# EAGLE design io-hub (EAGLE 5.10)
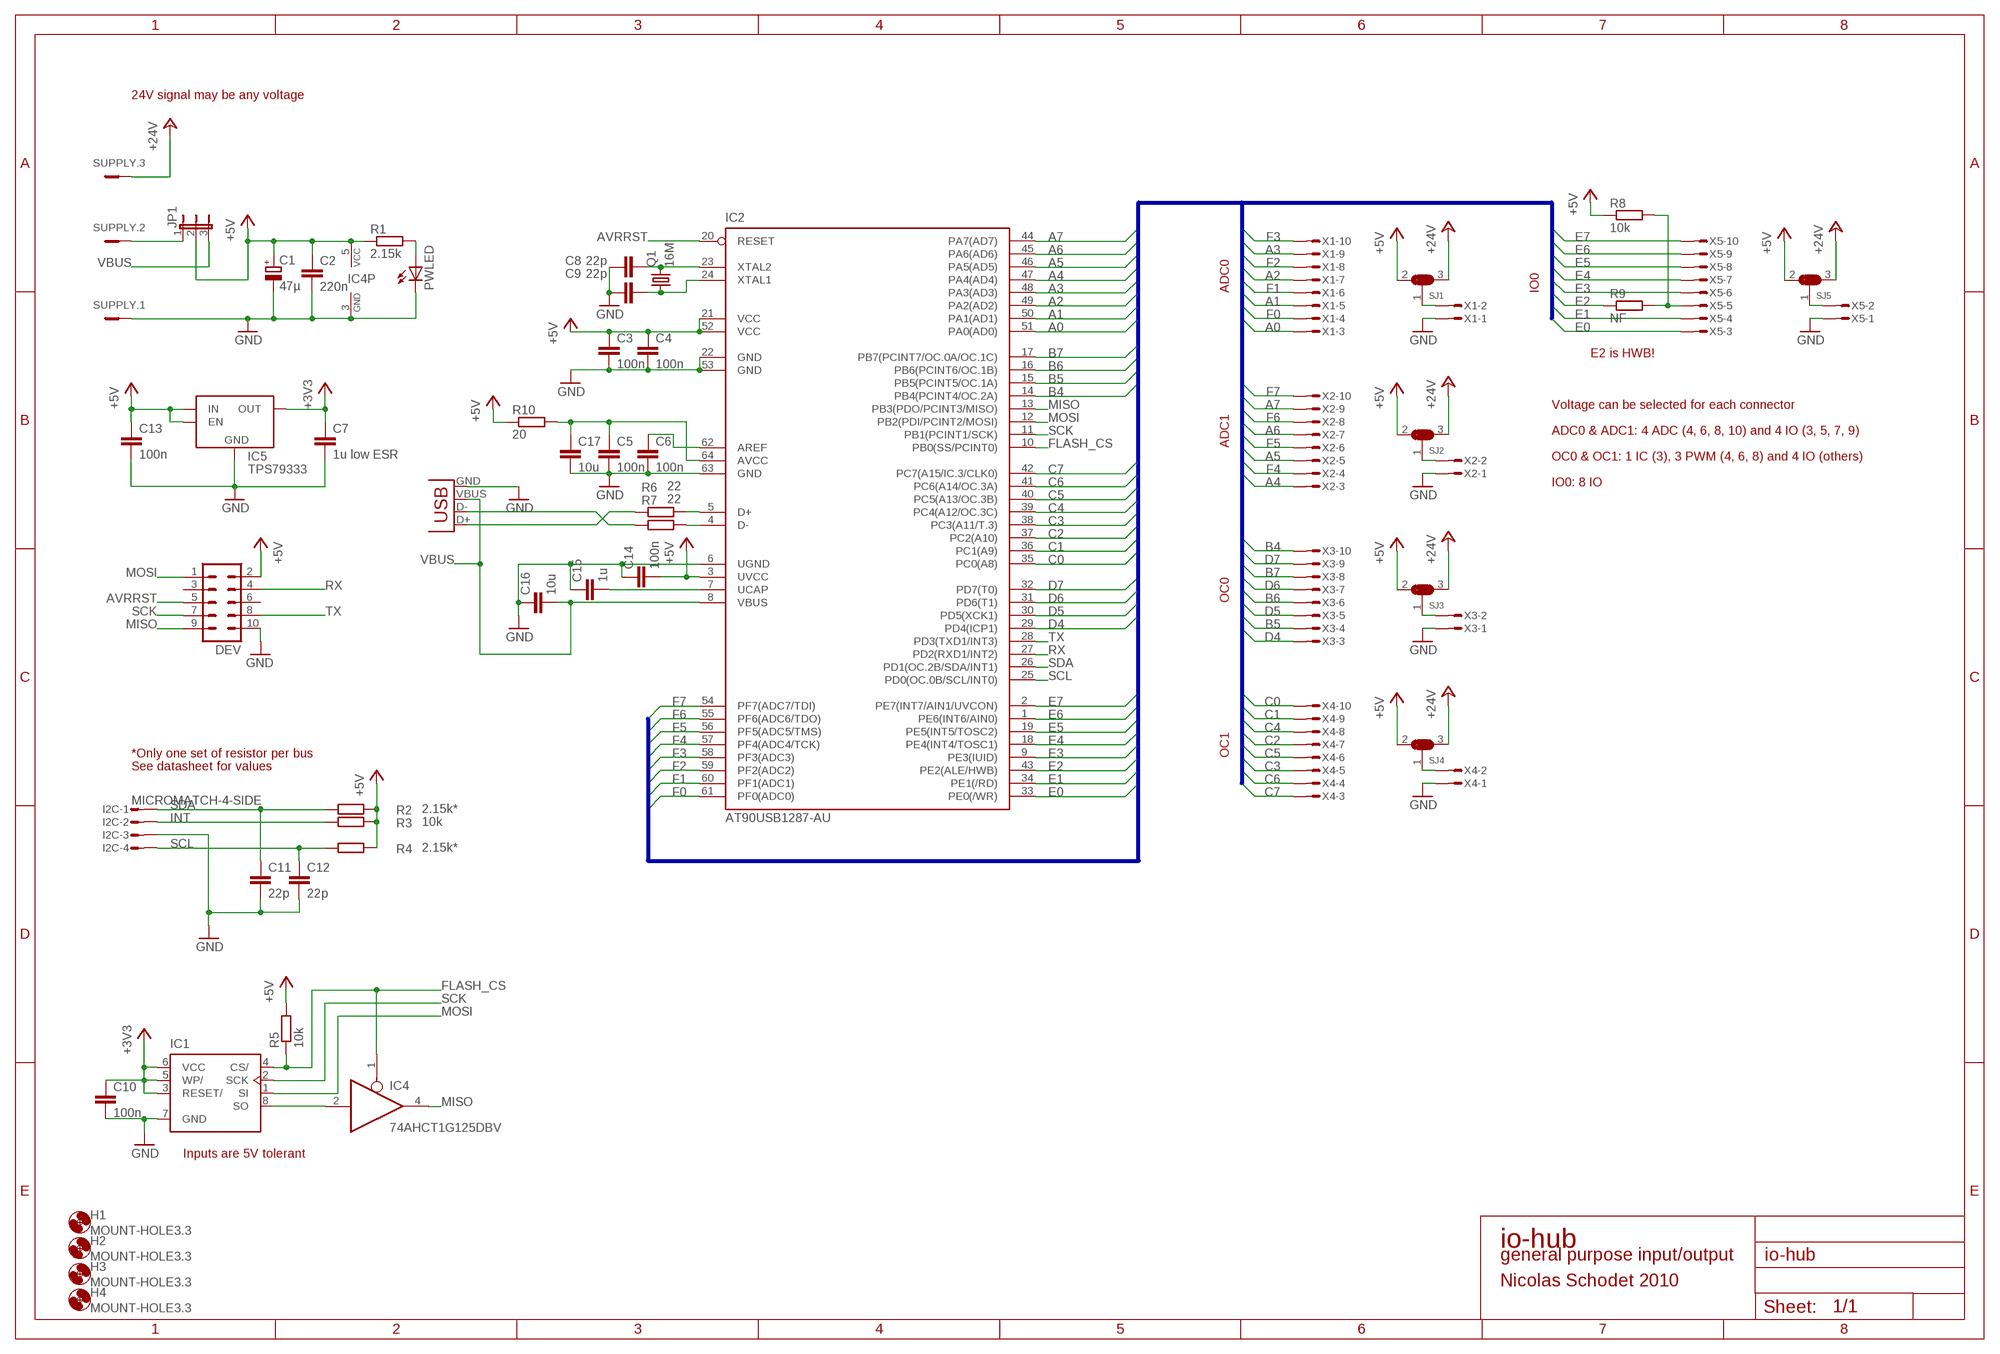
[diagram p0: schematic, sheet 1]

## Parts
C1  47µ  CPOL-EUC  [PANASONIC_C]
C2  220n  C-EUC0603  [C0603]
C3  100n  C-EUC0603  [C0603]
C4  100n  C-EUC0603  [C0603]
C5  100n  C-EUC0603  [C0603]
C6  100n  C-EUC0603  [C0603]
C7  1u low ESR  C-EUC0603  [C0603]
C8  22p  C-EUC0603  [C0603]
C9  22p  C-EUC0603  [C0603]
C10  100n  C-EUC0603  [C0603]
C11  22p  C-EUC0603  [C0603]
C12  22p  C-EUC0603  [C0603]
C13  100n  C-EUC0603  [C0603]
C14  100n  C-EUC0603  [C0603]
C15  1u  C-EUC0603  [C0603]
C16  10u  C-EUC0603  [C0603]
C17  10u  C-EUC0603  [C0603]
DEV  ML10L  [ML10L]
H1  MOUNT-HOLE3.3  [3,3]
H2  MOUNT-HOLE3.3  [3,3]
H3  MOUNT-HOLE3.3  [3,3]
H4  MOUNT-HOLE3.3  [3,3]
I2C  MICROMATCH-4-SIDE  [MICROMATCH-4-SIDE]
IC1  AT45DB  [SOIC8]
IC2  AT90USB1287-AU  [TQFP64]
IC4  74AHCT1G125DBV  [SOT23-5]
IC5  TPS79333  [SOT23-5]
JP1  JP2E  [JP2]
PWLED  LEDSMT1206  [1206]
Q1  16M  QUARTZ  [ABM3]
R1  2.15k  R-EU_R0603  [R0603]
R2  2.15k*  R-EU_R0603  [R0603]
R3  10k  R-EU_R0603  [R0603]
R4  2.15k*  R-EU_R0603  [R0603]
R5  10k  R-EU_R0603  [R0603]
R6  22  R-EU_R0603  [R0603]
R7  22  R-EU_R0603  [R0603]
R8  10k  R-EU_R0603  [R0603]
R9  NF  R-EU_R0603  [R0603]
R10  20  R-EU_R0603  [R0603]
SJ1  SJ2SMD  [SJ2-SMD]
SJ2  SJ2SMD  [SJ2-SMD]
SJ3  SJ2SMD  [SJ2-SMD]
SJ4  SJ2SMD  [SJ2-SMD]
SJ5  SJ2SMD  [SJ2-SMD]
SUPPLY  MC3  [MC3]
X1  MICROMATCH-10  [MICROMATCH-10]
X2  MICROMATCH-10  [MICROMATCH-10]
X3  MICROMATCH-10  [MICROMATCH-10]
X4  MICROMATCH-10  [MICROMATCH-10]
X5  MICROMATCH-10  [MICROMATCH-10]
X7  USB-MICROB-S  [USB-MICROB]

## Nets
+3V3: C7.1 C10.1 IC1.3(RESET/) IC1.5(WP/) IC1.6(VCC) IC5.5(OUT)
+5V [supply]: C1.+ C2.1 C3.1 C4.1 C13.1 C14.2 DEV.2 IC2.3(UVCC) IC2.21(VCC) IC2.52(VCC) IC4.5(VCC) IC5.1(IN) IC5.3(EN) JP1.2 R1.1 R2.2 R3.2 R4.2 R5.2 R8.1 R10.1 SJ1.2 SJ2.2 SJ3.2 SJ4.2 SJ5.2
+24V: SJ1.3 SJ2.3 SJ3.3 SJ4.3 SJ5.3 SUPPLY.3
A0: IC2.51(PA0(AD0)) X1.3
A1: IC2.50(PA1(AD1)) X1.5
A2: IC2.49(PA2(AD2)) X1.7
A3: IC2.48(PA3(AD3)) X1.9
A4: IC2.47(PA4(AD4)) X2.3
A5: IC2.46(PA5(AD5)) X2.5
A6: IC2.45(PA6(AD6)) X2.7
A7: IC2.44(PA7(AD7)) X2.9
AREF: C6.1 IC2.62(AREF)
AVCC [supply]: C5.1 C17.1 IC2.64(AVCC) R10.2
AVR_DM: IC2.4(D-) R7.2
AVR_DP: IC2.5(D+) R6.2
AVRCLK: C8.2 IC2.23(XTAL2) Q1.2
AVRRST: DEV.5 IC2.20(RESET)
B4: IC2.14(PB4(PCINT4/OC.2A)) X3.10
B5: IC2.15(PB5(PCINT5/OC.1A)) X3.4
B6: IC2.16(PB6(PCINT6/OC.1B)) X3.6
B7: IC2.17(PB7(PCINT7/OC.0A/OC.1C)) X3.8
C0: IC2.35(PC0(A8)) X4.10
C1: IC2.36(PC1(A9)) X4.9
C2: IC2.37(PC2(A10)) X4.7
C3: IC2.38(PC3(A11/T.3)) X4.5
C4: IC2.39(PC4(A12/OC.3C)) X4.8
C5: IC2.40(PC5(A13/OC.3B)) X4.6
C6: IC2.41(PC6(A14/OC.3A)) X4.4
C7: IC2.42(PC7(A15/IC.3/CLK0)) X4.3
D4: IC2.29(PD4(ICP1)) X3.3
D5: IC2.30(PD5(XCK1)) X3.5
D6: IC2.31(PD6(T1)) X3.7
D7: IC2.32(PD7(T0)) X3.9
DM: R7.1 X7.D-
DP: R6.1 X7.D+
E0: IC2.33(PE0(/WR)) X5.3
E1: IC2.34(PE1(/RD)) X5.4
E2: IC2.43(PE2(ALE/HWB)) R9.1
E2X: R8.2 R9.2 X5.5
E3: IC2.9(PE3(IUID)) X5.6
E4: IC2.18(PE4(INT4/TOSC1)) X5.7
E5: IC2.19(PE5(INT5/TOSC2)) X5.8
E6: IC2.1(PE6(INT6/AIN0)) X5.9
E7: IC2.2(PE7(INT7/AIN1/UVCON)) X5.10
F0: IC2.61(PF0(ADC0)) X1.4
F1: IC2.60(PF1(ADC1)) X1.6
F2: IC2.59(PF2(ADC2)) X1.8
F3: IC2.58(PF3(ADC3)) X1.10
F4: IC2.57(PF4(ADC4/TCK)) X2.4
F5: IC2.56(PF5(ADC5/TMS)) X2.6
F6: IC2.55(PF6(ADC6/TDO)) X2.8
F7: IC2.54(PF7(ADC7/TDI)) X2.10
FLASH_CS: IC1.4(CS/) IC2.10(PB0(SS/PCINT0)) IC4.1(OE) R5.1
FLASH_SO: IC1.8(SO) IC4.2(I)
GND [supply]: C1.- C2.2 C3.2 C4.2 C5.2 C6.2 C7.2 C8.1 C9.1 C10.2 C11.2 C12.2 C13.2 C14.1 C15.1 C16.1 C17.2 DEV.10 I2C.3 IC1.7(GND) IC2.6(UGND) IC2.22(GND) IC2.53(GND) IC2.63(GND) IC4.3(GND) IC5.2(GND) PWLED.C SUPPLY.1 X1.1 X2.1 X3.1 X4.1 X5.1 X7.GND
INT: I2C.2 R3.1
MISO: DEV.9 IC2.13(PB3(PDO/PCINT3/MISO)) IC4.4(O)
MOSI: DEV.1 IC1.1(SI) IC2.12(PB2(PDI/PCINT2/MOSI))
NPWLED: PWLED.A R1.2
RX: DEV.4 IC2.27(PD2(RXD1/INT2))
SCK: DEV.7 IC1.2(SCK) IC2.11(PB1(PCINT1/SCK))
SCL: C12.1 I2C.4 IC2.25(PD0(OC.0B/SCL/INT0)) R4.1
SDA: C11.1 I2C.1 IC2.26(PD1(OC.2B/SDA/INT1)) R2.1
TX: DEV.8 IC2.28(PD3(TXD1/INT3))
UCAP: C15.2 IC2.7(UCAP)
VBUS: C16.2 IC2.8(VBUS) JP1.3 X7.VBUS
X1V: SJ1.1 X1.2
X1V1: SJ5.1 X5.2
X2V: SJ2.1 X2.2
X3V: SJ3.1 X3.2
X4V: SJ4.1 X4.2
X5V: JP1.1 SUPPLY.2
XTAL1: C9.2 IC2.24(XTAL1) Q1.1
Unconnected: DEV.3 DEV.6

## Buses
F[0..7],A[0..7],B[4..7],C[0..7],D[4..7],E[0..7]

## Notes on the sheet
- 24V signal may be any voltage
- ADC0 | IO0
- E2 is HWB!
- Voltage can be selected for each connector
- ADC0 & ADC1: 4 ADC (4, 6, 8, 10) and 4 IO (3, 5, 7, 9)
- ADC1
- OC0 & OC1: 1 IC (3), 3 PWM (4, 6, 8) and 4 IO (others)
- IO0: 8 IO
- OC0
- *Only one set of resistor per bus | OC1
- See datasheet for values
- Inputs are 5V tolerant
- io-hub
- general purpose input/output
- Nicolas Schodet 2010

## Library data of the parts
C1 = rcl:CPOL-EU: POLARIZED CAPACITOR, European symbol
C2-C17 = rcl:C-EU: CAPACITOR, European symbol
DEV = con-harting-ml:ML10: HARTING
H1-H4 = holes:MOUNT-HOLE: MOUNTING HOLE with drill center marker
I2C = apbteam_con-amp-micromatch:MICROMATCH-4: MicroMaTch 4
IC1 = ni-flash:AT45DB: AT45DB Atmel SPI data flash serie
IC2 = at90usb:AT90USB1287-*: Atmel AT90USB1287 AVR Microcontroller with USB Interface and 128kB Flash Memory
IC4 = 74xx-little-us:74*1G125: Single Bus Buffer Gate with 3-State Output
IC5 = apbteam_v-reg:TPS793*: Low-power 150 mA low-dropout linear regulator TPS763xx familly
JP1 = jumper:JP2E: JUMPER
PWLED = led:LED: LED OSRAM: - CHIPLED LG R971, LG N971, LY N971, LG Q971, LY Q971, LO R971, LY R971 LH N974, LH R974 LS Q976, LO Q976, LY Q976 LO Q996 - Hyper CHIPLED LW Q18S LB Q993, LB Q99A, LB R99A - SideLED LS A670, LO A670, LY A670, LG A670, LP A670 LB A673, LV A673, LT A673, LW A673 LH A674 LY A675 LS A676, LA A676, LO A676, LY A676, LW A676 LS A679, LY A679, LG A679 - Hyper Micro SIDELED® LS Y876, LA Y876, LO Y876, LY Y876 LT Y87S - SmartLED LW L88C, LW L88S LB L89C, LB L89S, LG L890 LS L89K, LO L89K, LY L89K LS L896, LA L896, LO L896, LY L896 - TOPLED LS T670, LO T670, LY T670, LG T670, LP T670 LSG T670, LSP T670, LSY T670, LOP T670, LYG T670 LG T671, LOG T671, LSG T671 LB T673, LV T673, LT T673, LW T673 LH T674 LS T676, LA T676, LO T676, LY T676, LB T676, LH T676, LSB T676, LW T676 LB T67C, LV T67C, LT T67C, LS T67K, LO T67K, LY T67K, LW E67C LS E67B, LA E67B, LO E67B, LY E67B, LB E67C, LV E67C, LT E67C LW T67C LS T679, LY T679, LG T679 LS T770, LO T770, LY T770, LG T770, LP T770 LB T773, LV T773, LT T773, LW T773 LH T774 LS E675, LA E675, LY E675, LS T675 LS T776, LA T776, LO T776, LY T776, LB T776 LHGB T686 LT T68C, LB T68C - Hyper Mini TOPLED® LB M676 - Mini TOPLED Santana® LG M470 LS M47K, LO M47K, LY M47K Source: http://www.osram.convergy.de LUXEON: - LUMILED® LXK2-PW12-R00, LXK2-PW12-S00, LXK2-PW14-U00, LXK2-PW14-V00 LXK2-PM12-R00, LXK2-PM12-S00, LXK2-PM14-U00 LXK2-PE12-Q00, LXK2-PE12-R00, LXK2-PE12-S00, LXK2-PE14-T00, LXK2-PE14-U00 LXK2-PB12-K00, LXK2-PB12-L00, LXK2-PB12-M00, LXK2-PB14-N00, LXK2-PB14-P00, LXK2-PB14-Q00 LXK2-PR12-L00, LXK2-PR12-M00, LXK2-PR14-Q00, LXK2-PR14-R00 LXK2-PD12-Q00, LXK2-PD12-R00, LXK2-PD12-S00 LXK2-PH12-R00, LXK2-PH12-S00 LXK2-PL12-P00, LXK2-PL12-Q00, LXK2-PL12-R00 Source: www.luxeon.com KINGBRIGHT: KA-3528ASYC Source: www.kingbright.com
Q1 = ni-crystal:QUARTZ
R1-R10 = apbteam_rcl:R-EU_: RESISTOR, European symbol
SJ1-SJ5 = apbteam_jumper:SJ2: Jumper, 3 ways
SUPPLY = con-phoenix-381_l:MC3: Mini-Combicon 3.81mm horizontal 3-polig MC 1,5/3-G-3,81 Artikel-Nr. 1803280
X1-X5 = apbteam_con-amp-micromatch:MICROMATCH-10: MicroMaTch 10
X7 = apbteam_con-usb:USB: USB Connectors

## Net classes
1 supply: width 0.254 mm

## Board
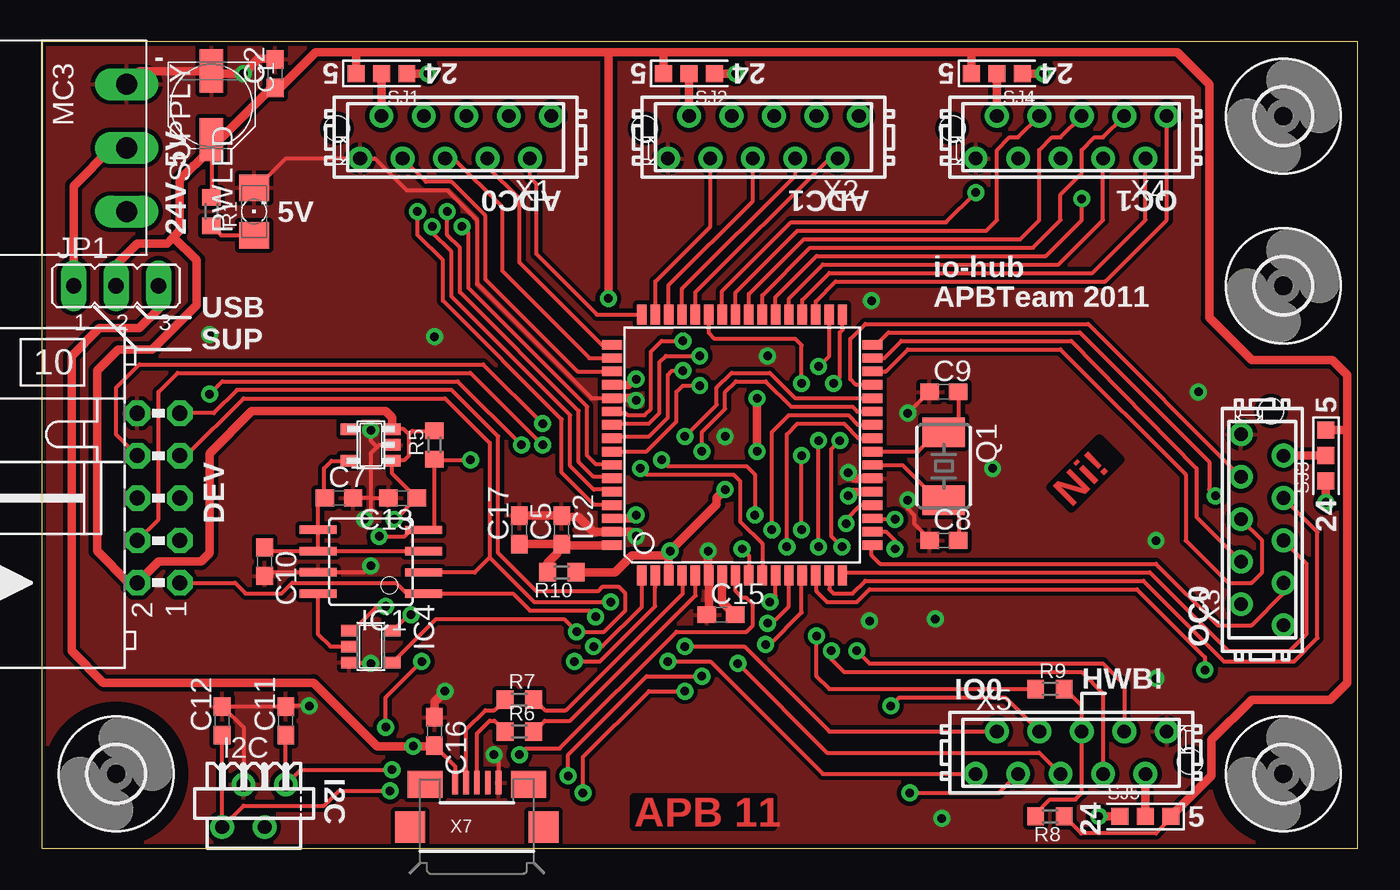
[diagram p1: board, top side]
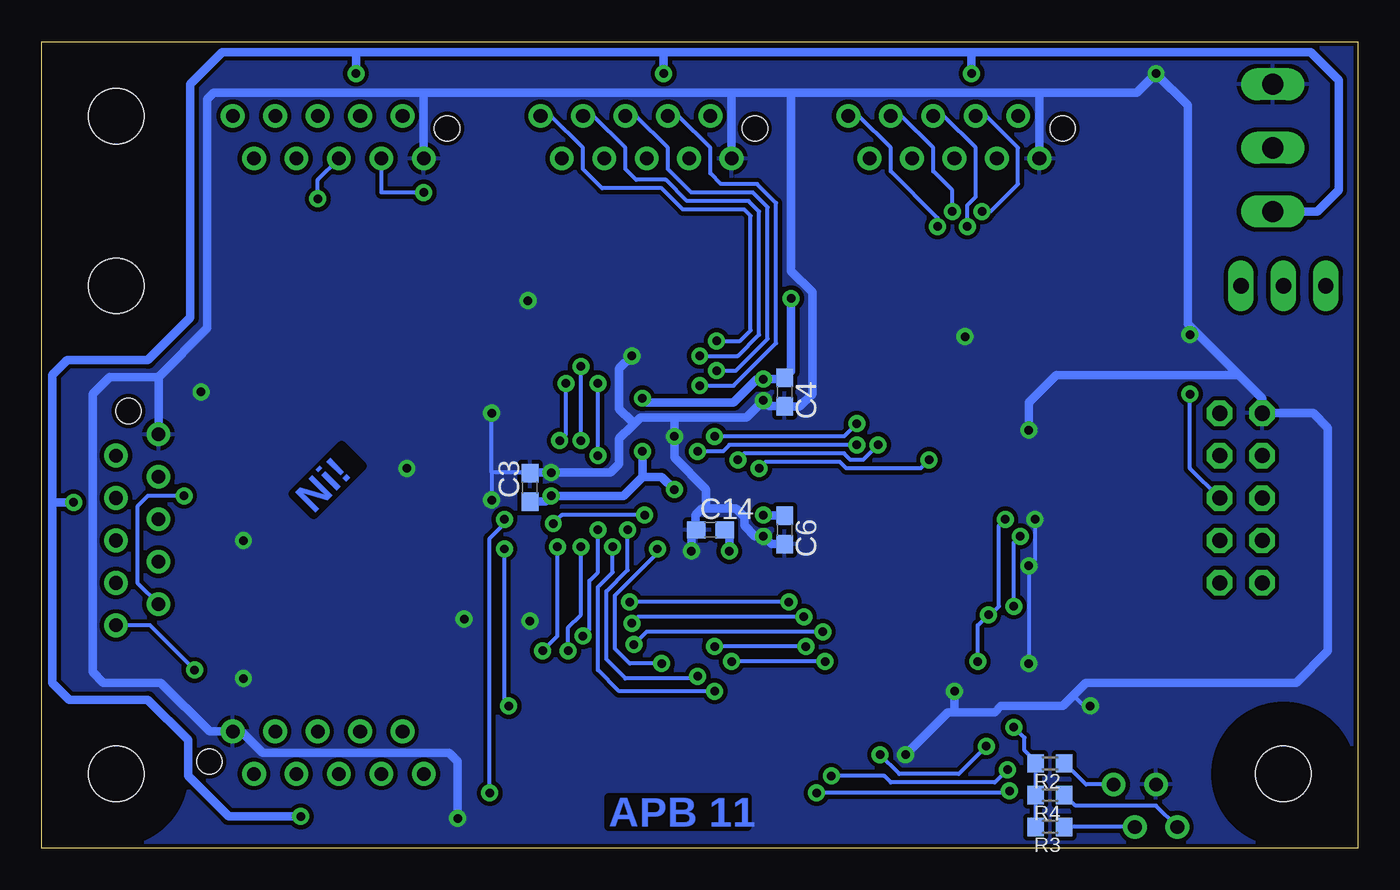
[diagram p2: board, bottom side, seen from below]

Size 78.74 x 48.26 mm. Coordinates in mm from the lower left corner, seen from the top.
Outline: 0,0 78.74,0 78.74,48.26 0,48.26 0,0
Copper layers (1*16): Top 0.035mm / dielectric 1.5mm / Bottom 0.035mm
Design rules "SparkFun": minimum track width 8mil, minimum drill 20mil, track to track 8mil, track to pad 8mil, pad to pad 8mil, via to via 8mil, smd to smd 8mil, copper to edge 10mil, drill to drill 8mil, minimum pad ring 12mil, minimum via ring 10mil, stop-mask expansion 4mil, vias tented up to drill 25mil, thermal gap 10mil

### Footprints (pad centres in the part's own frame; a part is rotated, then mirrored left to right if it is on the bottom)
PANASONIC_C = smd 2.6 x 1.4: + 2.05,0; - -2.05,0
C0603 = smd 1.1 x 1: 1 -0.85,0; 2 0.85,0
ML10L = drill 0.914 octagon: 1 -5.08,-1.27; 2 -5.08,1.27; 3 -2.54,-1.27; 4 -2.54,1.27; 5 0,-1.27; 6 0,1.27; 7 2.54,-1.27; 8 2.54,1.27; 9 5.08,-1.27; 10 5.08,1.27
3,3 = hole 3.3: 0,0
MICROMATCH-4-SIDE = drill 0.813 round: 1 1.905,1.27; 2 0.635,-1.27; 3 -0.635,1.27; 4 -1.905,-1.27
SOIC8 = smd 0.5 x 2.2: 1 -1.905,-3.154; 2 -0.645,-3.154; 3 0.625,-3.154; 4 1.895,-3.154; 5 1.905,3.154; 6 0.635,3.154; 7 -0.635,3.154; 8 -1.905,3.154
TQFP64 = smd 1.194 x 0.559: 1 -7.8,6; 2 -7.8,5.2; 3 -7.8,4.4; 4 -7.8,3.6; 5 -7.8,2.8; 6 -7.8,2; 7 -7.8,1.2; 8 -7.8,0.4; 9 -7.8,-0.4; 10 -7.8,-1.2; 11 -7.8,-2; 12 -7.8,-2.8; 13 -7.8,-3.6; 14 -7.8,-4.4; 15 -7.8,-5.2; 16 -7.8,-6; 33 7.8,-6; 34 7.8,-5.2; 35 7.8,-4.4; 36 7.8,-3.6; 37 7.8,-2.8; 38 7.8,-2; 39 7.8,-1.2; 40 7.8,-0.4; 41 7.8,0.4; 42 7.8,1.2; 43 7.8,2; 44 7.8,2.8; 45 7.8,3.6; 46 7.8,4.4; 47 7.8,5.2; 48 7.8,6 | smd 0.559 x 1.194: 17 -6,-7.8; 18 -5.2,-7.8; 19 -4.4,-7.8; 20 -3.6,-7.8; 21 -2.8,-7.8; 22 -2,-7.8; 23 -1.2,-7.8; 24 -0.4,-7.8; 25 0.4,-7.8; 26 1.2,-7.8; 27 2,-7.8; 28 2.8,-7.8; 29 3.6,-7.8; 30 4.4,-7.8; 31 5.2,-7.8; 32 6,-7.8; 49 6,7.8; 50 5.2,7.8; 51 4.4,7.8; 52 3.6,7.8; 53 2.8,7.8; 54 2,7.8; 55 1.2,7.8; 56 0.4,7.8; 57 -0.4,7.8; 58 -1.2,7.8; 59 -2,7.8; 60 -2.8,7.8; 61 -3.6,7.8; 62 -4.4,7.8; 63 -5.2,7.8; 64 -6,7.8
SOT23-5 = smd 0.69 x 0.99: 1 -0.95,-1.29; 2 0,-1.29; 3 0.95,-1.29; 4 0.95,1.3; 5 -0.95,1.3
JP2 = drill 0.914 long: 1 -2.54,0; 2 0,0; 3 2.54,0
1206 = smd 1.6 x 1.803: A -1.422,0; C 1.422,0
ABM3 = smd 1.778 x 2.54: 1 -2.032,0; 2 2.032,0
R0603 = smd 1 x 1.1: 1 -0.85,0; 2 0.85,0
SJ2-SMD = smd 1.016 x 1.016: 1 0,0; 2 -1.524,0; 3 1.524,0
MC3 = drill 1.27 long: 1 -3.81,0; 2 0,0; 3 3.81,0
MICROMATCH-10 = drill 0.813 round: 1 5.715,1.27; 2 4.445,-1.27; 3 3.175,1.27; 4 1.905,-1.27; 5 0.635,1.27; 6 -0.635,-1.27; 7 -1.905,1.27; 8 -3.175,-1.27; 9 -4.445,1.27; 10 -5.715,-1.27 | hole 1.5: 7.11,-0.53
USB-MICROB = smd 0.35 x 1.4: D+ 0,2.65; D- -0.65,2.65; GND 1.3,2.65; ID 0.65,2.65; VBUS -1.3,2.65 | smd 1.8 x 1.9: MT1 -4,0; MT2 4,0 | smd 2.1 x 1.6: MT3 -3.1,2.55; MT4 3.1,2.55

### Placement (x,y rotation side)
C1  10.16,44.45 270 top
C2  13.97,46.35 90 top
C3  49.53,21.59 90 bottom
C4  34.29,27.3 270 bottom
C5  31.11,19.05 90 top
C6  34.29,19.05 270 bottom
C7  17.78,20.95 0 top
C8  53.98,18.41 0 top
C9  53.98,27.3 0 top
C10  13.34,17.14 270 top
C11  14.61,7.62 90 top
C12  10.79,7.62 90 top
C13  21.59,20.95 180 top
C14  38.73,19.05 0 bottom
C15  40.64,13.97 0 top
C16  23.5,6.99 270 top
C17  28.57,19.05 90 top
DEV  6.99,20.95 90 top
H1  4.45,4.45 0 top
H2  74.3,4.45 0 top
H3  74.3,43.81 0 top
H4  74.3,33.66 0 top
I2C  12.7,2.54 0 top
IC1  19.68,17.14 90 top
IC2  41.91,24.13 90 top
IC4  19.68,12.06 270 top
IC5  19.68,24.13 90 top
JP1  4.45,33.66 0 top
PWLED  12.7,38.1 90 top
Q1  53.98,22.86 270 top
R1  10.16,38.1 270 top
R2  18.41,5.08 180 bottom
R3  18.41,1.27 180 bottom
R4  18.41,3.17 180 bottom
R5  23.5,24.13 90 top
R6  28.57,6.99 0 top
R7  28.57,8.89 0 top
R8  60.33,1.91 180 top
R9  60.33,9.53 0 top
R10  31.11,16.51 180 top
SJ1  20.32,46.35 0 top
SJ2  38.73,46.35 0 top
SJ3  76.83,23.5 270 top
SJ4  57.15,46.35 0 top
SJ5  66.04,1.91 180 top
SUPPLY  5.08,41.91 270 top
X1  24.77,42.55 180 top
X2  43.18,42.55 180 top
X3  73.03,19.05 90 top
X4  61.59,42.55 180 top
X5  61.59,5.71 0 top
X7  26.04,1.27 0 top

### Tracks (layer width: path | path; a pad name or v marks a point on that pad's centre or on a via)
+3V3
  Top 0.254: IC1.6 IC1.5 16.53,20.56 C7.1 16.89,20.99 16.89,22.73 17.34,23.18 IC5.5 | IC1.6 IC1.3 | IC1.6 13.55,17.78 C10.1
+5V  (via drill 0.51)
  Top 0.254: C1.+ R1.1 | IC5.3 21.66,25.08 21.97,24.77 | 21.97,24.77 21.97,23.5 21.72,23.24 21.04,23.24 IC5.1 20.98,22.42 C13.1 21.17,19.68 v21.08,19.68 | R5.2 22.19,24.98 21.97,24.77 | SJ5.2 67.56,1.78 66.67,0.89 62.19,0.89 R8.1 | v20.57,7.24 20.57,9.02 v22.73,11.18 | v22.1,13.97 21.94,13.97 IC4.5
  Top 0.508: 18.8,47.62 33.91,47.62 | 33.91,47.62 37.08,47.62 | 37.08,47.62 55.63,47.62 | 55.63,47.62 67.94,47.62 69.85,45.72 69.85,31.75 72.39,29.21 77.22,29.21 78.11,28.32 78.11,25.02 | 78.11,25.02 78.11,9.91 77.09,8.89 72.39,8.89 69.98,6.48 69.98,4.32 SJ5.2 | 78.11,25.02 SJ3.2 | 55.63,47.62 SJ4.2 | SJ2.2 37.21,47.5 37.08,47.62 | 18.8,47.62 SJ1.2 | 18.8,47.62 16.38,47.62 14.26,45.51 C2.1 13.76,45.51 10.79,42.55 10.3,42.55 C1.+ 10.03,42.27 10.03,41.78 8.26,40.01 8.26,36.96 7.87,36.58 | JP1.2 4.45,34.92 5.71,36.2 7.49,36.2 7.87,36.58 | IC2.3 37.51,17.7 v37.59,17.78 | IC2.21 48.51,21.33 v48.26,21.08 | IC2.52 35.1,27.73 35.43,28.07 v35.56,28.07 | 33.91,47.62 v33.91,32.89 | v37.59,17.78 37.34,17.53 35.31,17.53 34.29,16.51 R10.1 | v42.8,26.92 v42.8,23.75 | v40.89,21.46 40.39,20.95 40.39,20.57 v37.59,17.78 | 7.87,36.58 9.27,35.18 9.27,32.51 6.6,29.84 4.57,29.84 3.3,28.57 3.3,17.78 5.21,15.88 DEV.2 6.99,17.14 9.53,17.14 10.03,17.65 10.03,23.62 12.57,26.16 20.57,26.16 20.95,25.78 20.95,25.1 IC5.3
  Bottom 0.254: R3.2 R4.2 R2.2 19.27,5.17 19.94,5.84 19.94,6.6 v20.57,7.24 | v22.73,11.18 22.73,13.34 v22.1,13.97 21.97,13.97 21.46,14.48 21.46,19.3 v21.08,19.68
  Bottom 0.508: v37.59,17.78 37.59,18.76 C14.2 | C3.1 48.6,20.74 v48.26,21.08 43.94,21.08 42.8,22.23 | v33.91,32.89 33.91,28.54 C4.1 34.38,28.07 v35.56,28.07 35.94,28.07 37.34,26.67 42.55,26.67 v42.8,26.92 | v42.8,23.75 42.8,22.23 | 42.8,22.23 41.66,22.23 v40.89,21.46
+24V  (via drill 0.51)
  Top 0.508: v23.11,46.35 SJ1.3 | v63.25,1.91 SJ5.3 | v76.83,20.7 SJ3.3 | v59.94,46.35 SJ4.3 | v41.53,46.35 SJ2.3
  Bottom 0.508: 23.11,47.62 v23.11,46.35 | 59.94,47.62 67.94,47.62 69.85,45.72 69.85,31.75 72.39,29.21 77.22,29.21 78.11,28.32 78.11,20.7 | 41.66,47.62 59.94,47.62 | 23.11,47.62 41.66,47.62 | 78.11,20.7 78.11,9.91 77.09,8.89 72.39,8.89 69.98,6.48 69.98,4.32 67.56,1.91 v63.25,1.91 | 78.11,20.7 v76.83,20.7 | 59.94,47.62 v59.94,46.35 | v41.53,46.35 41.53,47.5 41.66,47.62 | 23.11,47.62 2.79,47.62 1.14,45.97 1.14,39.37 2.41,38.1 SUPPLY.3
A0
  Top 0.254: IC2.51 32.05,28.53 26.54,34.04 26.54,37.85 24.51,39.88 22.99,39.88 X1.3
A1
  Top 0.254: IC2.50 32.77,29.33 27.56,34.54 27.56,38.35 24.64,41.27 X1.5
A2
  Top 0.254: IC2.49 33.5,30.13 28.57,35.05 28.57,38.86 26.67,40.77 X1.7
A3
  Top 0.254: IC2.48 33.22,31.93 29.59,35.56 29.59,39.75 29.21,40.13 X1.9
A4
  Top 0.254: IC2.47 36.71,33.92 40.01,37.21 X2.3
A5
  Top 0.254: IC2.46 37.51,33.7 42.55,38.73 X2.5
A6
  Top 0.254: IC2.45 38.31,33.48 45.09,40.26 X2.7
A7
  Top 0.254: IC2.44 39.11,33.27 47.12,41.27 X2.9
AREF  (via drill 0.51)
  Top 0.508: IC2.62 35.35,19.73 v35.56,19.94
  Bottom 0.508: v35.56,19.94 35.52,19.9 C6.1
AVCC
  Top 0.508: IC2.64 31.18,18.13 C5.1 | C5.1 C17.1 | R10.2 30.27,17.06 30.86,17.65 30.86,17.95 C5.1
AVR_DM
  Top 0.254: R7.2 29.46,8.89 30.1,8.26 31.37,8.26 38.35,15.24 38.35,16.29 IC2.4
AVR_DP
  Top 0.254: R6.2 29.46,6.99 30.1,7.62 31.62,7.62 39.12,15.11 IC2.5
AVRCLK
  Top 0.254: IC2.23 51.49,22.93 53.47,20.95 53.85,20.95 Q1.2 54.86,20.83 54.86,18.45 C8.2
AVRRST  (via drill 0.51)
  Top 0.254: IC2.20 48.98,20.53 48.13,19.68 v48.13,19.43 | v42.67,19.94 42.67,22.35 42.16,22.86 37.47,22.86 v37.08,23.24 | v28.7,24.13 24.89,27.94 10.79,27.94 v10.03,27.18
  Bottom 0.254: v48.13,19.43 47.62,19.94 v42.67,19.94 | v37.08,23.24 36.7,23.62 30.73,23.62 30.35,23.24 29.59,23.24 v28.7,24.13 | v10.03,27.18 10.03,22.73 DEV.5
B4  (via drill 0.51)
  Top 0.254: IC2.14 46.35,16.29 46.35,15.37 46.99,14.73 48.77,14.73 49.53,15.49 65.53,15.49 69.6,11.43 v69.6,10.67
  Bottom 0.254: v69.6,10.67 72.26,13.34 X3.10
B5
  Top 0.254: IC2.15 47.12,15.49 47.37,15.24 48.51,15.24 49.28,16 65.91,16 70.74,11.18 74.93,11.18 76.33,12.57 76.33,18.92 X3.4
B6
  Top 0.254: IC2.16 48.09,16.51 66.29,16.51 70.99,11.81 74.68,11.81 75.69,12.83 75.69,17.02 X3.6
B7
  Top 0.254: IC2.17 49.66,18.08 49.66,17.53 50.16,17.02 66.67,17.02 70.36,13.34 72.39,13.34 74.3,15.24 X3.8
C0
  Top 0.254: IC2.35 46.31,32.72 47.5,33.91 63.63,33.91 67.31,37.59 X4.10
C1
  Top 0.254: IC2.36 45.51,32.81 47.12,34.42 62.87,34.42 66.04,37.59 X4.9
C2
  Top 0.254: IC2.37 44.71,32.9 46.74,34.92 60.83,34.92 63.5,37.59 X4.7
C3  (via drill 0.51)
  Top 0.254: IC2.38 43.91,32.99 46.35,35.43 60.07,35.43 62.23,37.59 v62.23,38.86
  Bottom 0.254: v62.23,38.86 62.23,40.01 X4.5
C4
  Top 0.254: IC2.39 43.11,33.08 45.97,35.94 59.31,35.94 60.96,37.59 60.96,39.12 62.23,40.39 62.23,41.78 62.99,42.55 63.5,42.55 X4.8
C5
  Top 0.254: IC2.40 42.31,33.17 45.59,36.45 58.55,36.45 59.69,37.59 59.69,41.78 60.45,42.55 60.96,42.55 X4.6
C6
  Top 0.254: IC2.41 41.51,33.26 45.21,36.96 56.52,36.96 57.15,37.59 57.15,41.78 57.91,42.55 58.42,42.55 X4.4
C7  (via drill 0.51)
  Top 0.254: IC2.42 40.71,33.34 44.83,37.47 54.1,37.47 v55.88,39.24
  Bottom 0.254: v55.88,39.24 58.42,39.24 X4.3
D4
  Top 0.254: IC2.29 48.72,27.73 48.39,28.07 48.39,30.48 49.28,31.37 62.61,31.37 X3.3
D5
  Top 0.254: IC2.30 50.5,28.53 51.82,29.84 60.96,29.84 68.45,22.35 68.45,18.41 70.99,15.88 72.39,15.88 73.03,16.51 73.03,18.41 X3.5
D6
  Top 0.254: IC2.31 50.41,29.33 51.44,30.35 61.59,30.35 69.09,22.73 69.09,19.81 X3.7
D7  (via drill 0.51)
  Top 0.254: IC2.32 49.94,30.13 50.67,30.86 62.1,30.86 69.85,23.11 69.85,21.46 v70.23,21.08
  Bottom 0.254: v70.23,21.08 72.39,21.08 73.03,20.45 73.03,15.88 X3.9
DM
  Top 0.254: X7.D- 25.39,7.1 26.54,8.26 27.09,8.26 R7.1
DP
  Top 0.254: X7.D+ 26.04,6.86 26.8,7.62 27.09,7.62 R6.1
E0  (via drill 0.51)
  Top 0.254: IC2.33 47.91,31.02 47.75,30.86 47.75,28.19 v47.37,27.81 | v47.75,24.38 47.24,23.88 47.24,18.67 v47.88,18.03 | v48.77,11.81 49.53,11.05 63.5,11.05 64.77,9.78 X5.3
  Bottom 0.254: v47.37,27.81 47.37,24.77 v47.75,24.38 | v47.88,18.03 47.88,12.7 v48.77,11.81
E1  (via drill 0.51)
  Top 0.254: v46.48,28.83 47.12,29.46 IC2.34 | v46.48,18.03 v46.48,24.38 | v47.24,11.81 47.24,11.3 48.01,10.54 62.23,10.54 63.5,9.27 X5.4
  Bottom 0.254: v46.48,24.38 v46.48,28.83 | v46.48,18.03 46.48,13.97 47.24,13.21 v47.24,11.81
E2  (via drill 0.51)
  Top 0.254: IC2.43 39.91,30.83 40.26,30.48 45.09,30.48 45.47,30.1 v45.47,27.81 | v45.47,19.05 v45.47,23.5 | v46.35,12.7 46.35,10.29 47.12,9.53 R9.1
  Bottom 0.254: v45.47,23.5 v45.47,27.81 | v45.47,19.05 45.47,16.51 45.97,16 45.97,13.08 v46.35,12.7
E2X
  Top 0.254: R8.2 59.48,2.07 60.33,2.92 61.85,2.92 62.23,3.3 X5.5 62.23,8.51 61.21,9.53 R9.2
E3  (via drill 0.51)
  Top 0.254: IC2.9 42.31,17.51 v41.91,17.91 | v41.66,11.05 46.99,5.71 59.69,5.71 X5.6
  Bottom 0.254: v41.91,17.91 41.91,17.65 44.45,15.11 44.45,11.94 43.56,11.05 v41.66,11.05
E4  (via drill 0.51)
  Top 0.254: IC2.18 50.54,18.93 51.05,18.41 v51.05,17.91 | v50.8,8.51 51.31,9.02 57.66,9.02 58.04,8.64 X5.7
  Bottom 0.254: v50.8,8.51 51.05,8.76 v51.05,17.91
E5  (via drill 0.51)
  Top 0.254: IC2.19 49.66,19.68 v51.05,19.68 | v51.94,3.3 57.28,3.3 X5.8
  Bottom 0.254: v51.05,19.68 51.05,19.43 51.94,18.54 v51.94,3.3
E6  (via drill 0.51)
  Top 0.254: IC2.1 35.91,14.45 33.53,12.06 v33.02,12.06 | v38.48,12.06 42.04,12.06 47.12,6.99 X5.9
  Bottom 0.254: v33.02,12.06 v38.48,12.06
E7  (via drill 0.51)
  Top 0.254: IC2.2 36.71,15.61 36.7,15.62 36.7,14.48 33.4,11.18 v31.88,11.18 | v37.47,11.18 40.01,11.18 46.74,4.45 X5.10
  Bottom 0.254: v31.88,11.18 v37.47,11.18
F0  (via drill 0.51)
  Top 0.254: v22.48,38.1 22.48,36.7 24,35.18 24,32.77 31.11,25.65 31.11,22.48 33.02,20.57 34.07,20.57 IC2.61
  Bottom 0.254: X1.4 22.23,43.81 20.32,41.91 20.32,39.75 21.97,38.1 v22.48,38.1
F1  (via drill 0.51)
  Top 0.254: v23.37,37.21 23.37,36.83 24.51,35.69 24.51,33.02 31.62,25.91 31.62,22.86 33.02,21.46 33.98,21.46 IC2.60
  Bottom 0.254: X1.6 24.77,43.81 22.86,41.91 22.86,38.99 23.37,38.48 v23.37,37.21
F2  (via drill 0.51)
  Top 0.254: v24.26,38.1 24.26,36.7 25.02,35.94 25.02,33.27 32.13,26.16 32.13,23.11 33.02,22.23 34.02,22.23 IC2.59
  Bottom 0.254: X1.8 27.3,43.81 25.4,41.91 25.4,40.51 24.26,39.37 v24.26,38.1
F3  (via drill 0.51)
  Top 0.254: v25.15,37.21 25.53,36.83 25.53,33.53 32.64,26.42 32.64,23.5 33.15,22.99 34.05,22.99 IC2.58
  Bottom 0.254: X1.10 29.84,43.81 27.94,41.91 27.94,40.51 25.15,37.72 v25.15,37.21
F4  (via drill 0.51)
  Top 0.254: v39.37,27.69 38.35,27.69 37.97,27.3 37.97,25.53 36.2,23.75 34.13,23.75 IC2.57
  Bottom 0.254: X2.4 40.64,43.81 38.73,41.91 38.73,40.39 38.1,39.75 35.94,39.75 34.8,38.61 34.8,30.23 37.34,27.69 v39.37,27.69
F5  (via drill 0.51)
  Top 0.254: v38.35,28.57 37.72,28.57 37.47,28.32 37.47,25.78 36.32,24.64 34.22,24.64 IC2.56
  Bottom 0.254: X2.6 43.18,43.81 41.27,41.91 41.27,40.64 39.88,39.24 36.2,39.24 35.31,38.35 35.31,30.48 37.21,28.57 v38.35,28.57
F6  (via drill 0.51)
  Top 0.254: v39.37,29.46 37.34,29.46 36.96,29.08 36.96,26.04 36.32,25.4 34.18,25.4 IC2.55
  Bottom 0.254: X2.8 45.72,43.81 43.81,41.91 43.81,40.64 43.18,40.01 41.4,40.01 40.13,38.73 36.45,38.73 35.81,38.1 35.81,30.73 37.08,29.46 v39.37,29.46
F7  (via drill 0.51)
  Top 0.254: v38.35,30.35 37.08,30.35 36.45,29.72 36.45,26.29 36.07,25.91 35.05,25.91 34.92,26.04 34.2,26.04 IC2.54
  Bottom 0.254: X2.10 48.26,43.81 46.35,41.91 46.35,40.64 45.21,39.5 41.66,39.5 40.39,38.23 36.7,38.23 36.32,37.85 36.32,30.99 36.96,30.35 v38.35,30.35
FLASH_CS  (via drill 0.51)
  Top 0.254: IC2.10 43.11,18.23 41.78,19.56 41.78,21.97 41.4,22.35 36.2,22.35 v35.81,22.73 | v25.65,23.24 23.53,23.24 R5.1 23.5,19.05 23.48,19.04 IC1.4 22.1,19.05 21.72,18.67 v20.19,18.67 | IC4.1 18.6,13.02 20.07,14.48 v20.57,14.48
  Bottom 0.254: v35.81,22.73 35.43,23.11 30.99,23.11 30.61,22.73 26.16,22.73 v25.65,23.24 | v20.57,14.48 20.57,18.29 v20.19,18.67
FLASH_SO
  Top 0.254: IC1.8 16.53,12.81 17.27,12.06 IC4.2
GND  (via drill 0.51)
  Top 0.254: 34.27,26.93 32.89,26.93 26.04,33.78 26.04,37.59 24.26,39.37 21.84,39.37 19.94,41.27 X1.1 14.61,41.27 12.85,39.52 PWLED.C | v51.82,26.04 53.09,27.3 C9.1 | v51.82,20.83 51.82,20.32 52.2,19.94 52.2,19.43 53.09,18.54 53.09,18.41 C8.1 | C10.2 13.55,16.51 IC1.7 19.3,16.51 v19.68,16.89 | IC5.2 20.19,24.13 20.07,24 | 20.07,24 19.68,23.62 19.68,20.95 | 19.68,20.95 C7.2 | 19.68,20.95 C13.2 | v19.3,19.68 19.68,20.07 19.68,20.95 | I2C.3 12.06,7.24 10.83,8.47 C12.2 C11.2 14.69,8.47 14.73,8.51 v16,8.51 | v19.68,25.02 19.68,24.38 20.07,24 | v19.68,11.05 18.46,11.05 IC4.3 | X7.GND 27.34,5.3 v27.05,5.59
  Top 0.508: C2.2 13.93,47.24 12.95,47.24 v12.06,46.35 10.3,46.35 C1.- 5.86,46.5 SUPPLY.1 | v39.88,17.78 39.88,16.38 39.91,16.35 IC2.6 39.91,14.09 C15.1 | IC2.22 48.61,22.13 v48.26,22.48 | IC2.53 34.27,26.93 35.43,26.93 v35.56,26.8 | C17.2 C5.2 31.2,19.81 32.13,19.81 33.01,18.93 IC2.63 35.3,18.93 v35.56,18.67 | C16.1 23.5,8.76 v24.13,9.4
  Bottom 0.254: 51.82,22.48 v51.82,20.83 | 51.82,22.48 v51.82,26.04 | 49.49,22.48 51.82,22.48 | v19.3,19.68 19.3,17.27 v19.68,16.89 v19.68,11.05 | v16,8.51 16.38,8.51 17.02,9.14
  Bottom 0.508: 19.05,45.21 X1.1 | 19.05,45.21 33.91,45.21 | 33.91,45.21 37.47,45.21 | 37.47,45.21 55.88,45.21 | 55.88,45.21 68.45,45.21 68.83,44.83 68.83,31.11 71.75,28.19 | 71.75,28.19 74.68,28.19 75.69,27.18 75.69,10.54 75.06,9.91 71.63,9.91 68.71,6.99 X5.1 66.8,6.99 65.53,5.71 54.36,5.71 53.85,5.21 v53.85,1.78 | 19.05,45.21 13.21,45.21 v12.06,46.35 10.16,44.45 10.16,31.37 7.11,28.32 | 37.47,45.21 X2.1 | 55.88,45.21 X4.1 | 71.75,28.19 X3.1 | v39.88,17.78 39.88,18.76 C14.1 39.62,19.09 39.62,19.94 39.24,20.32 38.99,20.32 | C3.2 49.49,22.48 v48.26,22.48 44.7,22.48 44.2,22.99 44.2,24.51 43.43,25.27 | C4.2 35.22,26.45 v35.56,26.8 36.58,25.78 40.89,25.78 | C6.2 35.09,18.2 v35.56,18.67 36.07,18.67 36.7,19.3 36.7,19.81 37.21,20.32 37.72,20.32 | 33.91,45.21 33.91,34.54 32.64,33.27 32.64,27.18 33.4,26.42 34.29,26.42 | 38.99,20.32 37.72,20.32 | 37.72,20.32 37.59,20.45 | 40.89,25.78 42.93,25.78 43.43,25.27 | 40.89,25.78 v40.89,24.64 40.89,23.37 38.99,21.46 38.99,20.32 | v19.68,25.02 19.68,26.67 18.03,28.32 7.11,28.32 | 7.11,28.32 5.71,26.92 DEV.10 2.67,26.04 1.78,25.15 1.78,11.81 3.68,9.91 16.26,9.91 17.02,9.14 17.65,8.51 21.34,8.51 21.72,8.13 24.13,8.13 | v27.05,5.59 24.51,8.13 24.13,8.13 | 24.13,8.13 v24.13,9.4 | 43.43,25.27 43.43,25.53 44.2,26.29 44.2,28.7 v43.43,29.46
  other vias: 49.53,13.59 53.47,13.72 66.67,10.16 56.9,22.73 23.5,30.61 10.03,30.73 49.66,32.77 66.67,18.41 69.22,27.3
  pour Top (isolate 0.254): 0,48.26 78.74,48.26 78.74,0 0,0
  pour Bottom (isolate 0.254): 0,48.26 78.74,48.26 78.74,0 0,0
INT
  Bottom 0.254: I2C.2 R3.1
MISO  (via drill 0.51)
  Top 0.254: DEV.9 10.29,26.04 11.68,27.43 24.51,27.43 27.3,24.64 27.3,17.65 29.59,15.37 33.27,15.37 33.53,15.62 34.54,15.62 34.92,15.24 34.92,14.22 33.66,12.95 v32,12.95 31.24,13.72 23.59,13.72 IC4.4 | v43.31,12.19 43.56,12.19 45.47,14.1 45.47,16.29 IC2.13
  Bottom 0.254: v32,12.95 42.55,12.95 v43.31,12.19
MOSI  (via drill 0.51)
  Top 0.254: v33.15,13.84 32.77,14.22 29.21,14.22 28.19,15.24 IC1.1 21.84,15.24 21.21,15.88 14.99,15.88 14.35,15.24 12.19,15.24 11.56,15.88 DEV.1 | v43.43,13.46 43.69,13.46 44.7,14.48 IC2.12
  Bottom 0.254: v33.15,13.84 43.05,13.84 v43.43,13.46
NPWLED
  Top 0.254: PWLED.A 10.73,36.68 R1.2
RX  (via drill 0.51)
  Top 0.254: IC2.27 48.8,26.13 48.51,26.42 44.83,26.42 43.31,27.94 41.53,27.94 40.89,27.3 40.89,26.29 39.5,24.89 v39.5,23.75 | v29.97,24.13 25.65,28.45 8.13,28.45 6.99,27.3 6.99,19.68 DEV.4
  Bottom 0.254: v39.5,23.75 37.97,23.75 37.59,24.13 v29.97,24.13
SCK  (via drill 0.51)
  Top 0.254: IC2.11 43.91,15.08 v43.56,14.73 | 26.8,17.4 26.8,24.26 24.13,26.92 12.06,26.92 8.64,23.5 DEV.7 | 26.8,17.4 29.46,14.73 v34.04,14.73 | IC1.2 25.9,16.5 26.8,17.4
  Bottom 0.254: v34.04,14.73 v43.56,14.73
SCL  (via drill 0.51)
  Top 0.254: IC2.25 48.88,24.53 48.01,25.4 45.21,25.4 44.58,24.77 v44.58,18.03 | C12.1 I2C.4 12.06,2.54 16.89,2.54 17.78,3.43 v20.83,3.43 | v38.48,9.4 36.32,9.4 32.38,5.46 v32.38,3.3
  Bottom 0.254: R4.1 17.53,3.17 16.89,2.54 12.06,2.54 I2C.4 | v44.58,18.03 44.58,16.51 45.47,15.62 45.47,10.67 44.2,9.4 v38.48,9.4 | v32.38,3.3 20.95,3.3 v20.83,3.43
SDA  (via drill 0.51)
  Top 0.254: IC2.26 48.84,25.33 48.26,25.91 44.7,25.91 43.69,24.89 v43.69,19.05 | C11.1 I2C.1 15.49,4.7 v20.95,4.7 | v39.5,10.29 36.2,10.29 31.5,5.59 v31.5,4.32
  Bottom 0.254: R2.1 17.53,5.08 16.26,3.81 I2C.1 | v43.69,19.05 43.69,16.64 44.96,15.37 44.96,11.3 43.81,10.16 39.62,10.16 v39.5,10.29 | v31.5,4.32 28.32,4.32 27.94,3.94 21.72,3.94 v20.95,4.7
TX  (via drill 0.51)
  Top 0.254: v38.48,24.64 40.39,26.55 40.39,27.56 41.27,28.45 43.56,28.45 45.08,26.93 IC2.28 | v29.97,25.4 26.42,28.96 5.84,28.96 4.45,27.56 4.45,24.77 DEV.8
  Bottom 0.254: v38.48,24.64 30.73,24.64 v29.97,25.4
UCAP
  Top 0.508: IC2.7 40.71,14.75 C15.2
VBUS  (via drill 0.51)
  Top 0.254: IC2.8 41.51,15.39 41.91,14.99 42.16,14.99 42.55,14.61 42.55,13.34 42.16,12.95 37.97,12.95 30.99,5.97 28.96,5.97 v28.57,5.59 | X7.VBUS 24.73,4.89 C16.2
  Top 0.508: JP1.3 6.99,32.26 5.84,31.11 3.43,31.11 1.78,29.46 1.78,11.81 3.68,9.91 16.26,9.91 20.07,6.1 v22.23,6.1 23.46,6.1 C16.2
  Bottom 0.254: v22.23,6.1 23.88,4.45 27.43,4.45 v28.57,5.59
X1V
  Top 0.508: X1.2 SJ1.1
X1V1
  Top 0.508: SJ5.1 X5.2
X2V
  Top 0.508: X2.2 SJ2.1
X3V
  Top 0.508: X3.2 SJ3.1
X4V
  Top 0.508: X4.2 SJ4.1
X5V
  Top 0.508: SUPPLY.2 4.19,41.91 1.91,39.62 JP1.1
XTAL1
  Top 0.254: IC2.24 52.43,23.73 53.34,24.64 53.72,24.64 Q1.1 54.86,24.89 54.86,27.27 C9.2

### Text on the board
Top: Ni! | APB 11
Bottom: Ni! | APB 11
tSilk: - | 5 | 24 | 5 | 24 | 5 | 24 | 5V | 24V | ADC0 | ADC1 | OC1 | 5V | io-hub | USB | APBTeam 2011 | SUP | 5 | DEV | 24 | OC0 | HWB! | IO0 | I2C | 24 | 5